# Altium project SVPXFMC_Carrier_3U.PrjPcb (part 7 of 7)

## Sheet SVPX_protection.SchDoc: SVPXFMC Carrier 3U
size A4; CheckedBy: \; Author: G.Kasprowicz; CompanyName: ISE; DrawnBy: T.Przywozki; Organization: WUT ISE; Address1: Warsaw University of Technology; Address2: Nowowiejska 15/19 00-665 Warsaw; Revision: 1.0.; SheetNumber: 19; SheetTotal: 20; Project: SVPXFMC Carrier 3U; ModifiedBy: -; CheckedDate: -; Title2: SpaceVPX interface protection; DivGrp: ISE; Designer: G. Kasprowicz
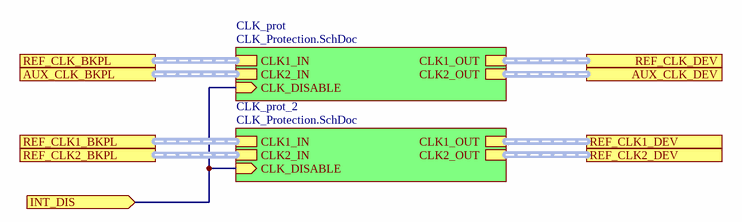
[diagram p19: SVPX_protection.SchDoc]

### Sub-sheets
CLK_prot = CLK_Protection.SchDoc: CLK_DISABLE (in), CLK1_IN (harness CLK), CLK2_IN (harness CLK), CLK2_OUT (harness CLK), CLK1_OUT (harness CLK)
CLK_prot_2 = CLK_Protection.SchDoc: CLK_DISABLE (in), CLK1_IN (harness CLK), CLK2_IN (harness CLK), CLK2_OUT (harness CLK), CLK1_OUT (harness CLK)

### Ports
AUX_CLK_BKPL (harness CLK), AUX_CLK_DEV (harness CLK), INT_DIS (in), REF_CLK1_BKPL (harness CLK), REF_CLK1_DEV (harness CLK), REF_CLK2_BKPL (harness CLK), REF_CLK2_DEV (harness CLK), REF_CLK_BKPL (harness CLK), REF_CLK_DEV (harness CLK)

### Nets
DIS_LVDS: port INT_DIS, sheet CLK_prot/CLK_DISABLE, sheet CLK_prot_2/CLK_DISABLE

### Buses and harness runs
harness port AUX_CLK_BKPL = sheet CLK_prot/CLK2_IN
harness port AUX_CLK_DEV = sheet CLK_prot/CLK2_OUT
harness port REF_CLK1_BKPL = sheet CLK_prot_2/CLK1_IN
harness port REF_CLK1_DEV = sheet CLK_prot_2/CLK1_OUT
harness port REF_CLK2_BKPL = sheet CLK_prot_2/CLK2_IN
harness port REF_CLK2_DEV = sheet CLK_prot_2/CLK2_OUT
harness port REF_CLK_BKPL = sheet CLK_prot/CLK1_IN
harness port REF_CLK_DEV = sheet CLK_prot/CLK1_OUT

### Notes on the sheet
- Project/Equipment
- Document
- Designer
- Drawn by
- Check.by
- Copyright WUT ISE 2019
  This documentation describes Open Hardware and is licensed under the CERN OHL v.1.1. You may redistribute and modify this documentation under the terms of the CERN OHL v1.1.
  (http://ohwr.org/CERNOHL). This documentation is dristributed WITHOUT ANY EXPRESS OR IMPLIED WARRANTY, INCLUDING OF MERCHANTABILITY, SATISFACTORY QUALITY AND FITNESS FOR A PARTICULAR PURPOSE. Please see the CERN OHL v.1.1 for applicable conditions
- File
- Last Mod.
- Print Date
- Sheet
- Size
- A4
- of
- Rev

## Sheet CLK_Protection.SchDoc: SVPXFMC Carrier 3U
size A4; CheckedBy: \; Author: G.Kasprowicz; CompanyName: ISE; DrawnBy: T.Przywozki; Organization: WUT ISE; Address1: Warsaw University of Technology; Address2: Nowowiejska 15/19 00-665 Warsaw; Revision: 1.0.; SheetNumber: 20; SheetTotal: 20; Project: SVPXFMC Carrier 3U; ModifiedBy: -; CheckedDate: -; Title2: Clock protection; DivGrp: ISE; Designer: G. Kasprowicz
Used 2 times, as channels U_SVPX_protection/CLK_prot, U_SVPX_protection/CLK_prot_2. Parts and nets are listed once, with the designators drawn on the sheet.
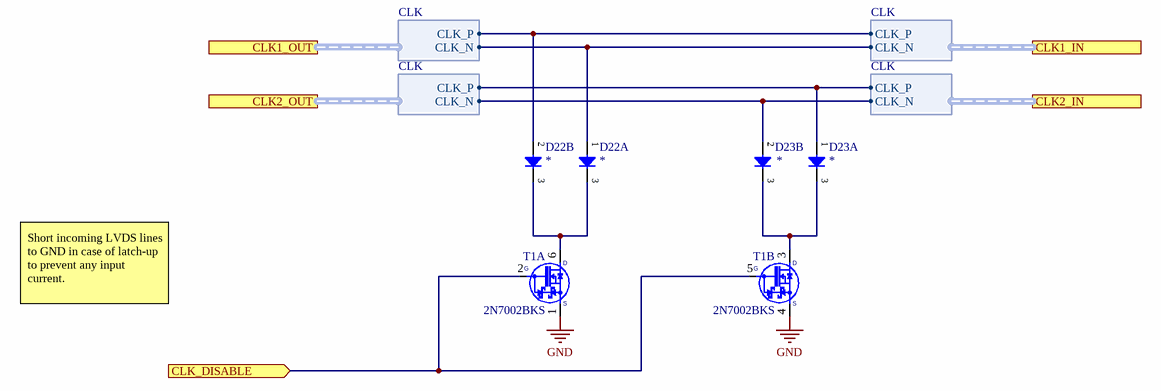
[diagram p20: CLK_Protection.SchDoc]

### Parts
D22  *  [SOT65P210X110-3N]  (parts A,B of 2)
D23  *  [SOT65P210X110-3N]  (parts A,B of 2)
T1  2N7002BKS  [SOT65P210X110-6N]  (parts A,B of 2)

### Ports
CLK1_IN (harness CLK), CLK1_OUT (harness CLK), CLK2_IN (harness CLK), CLK2_OUT (harness CLK), CLK_DISABLE (in)

### Harnesses
CLK: CLK_P, CLK_N

### Nets
GND: T1.1(S) T1.4(S)
CLK_DISABLE: T1.2(G) T1.5(G) ; port CLK_DISABLE
NetD22_1: D22.1(A) ; port CLK1_IN.CLK_N, port CLK1_OUT.CLK_N
NetD22_2: D22.2(A) ; port CLK1_IN.CLK_P, port CLK1_OUT.CLK_P
NetD22_3: D22.3(COMC) T1.6(D)
NetD23_1: D23.1(A) ; port CLK2_IN.CLK_P, port CLK2_OUT.CLK_P
NetD23_2: D23.2(A) ; port CLK2_IN.CLK_N, port CLK2_OUT.CLK_N
NetD23_3: D23.3(COMC) T1.3(D)

### Channels
U_SVPX_protection/CLK_prot: designators end in A; ports CLK_DISABLE=DIS_LVDS
U_SVPX_protection/CLK_prot_2: designators end in B; ports CLK_DISABLE=DIS_LVDS

### Notes on the sheet
- Short incoming LVDS lines to GND in case of latch-up to prevent any input current.
- Project/Equipment
- Document
- Designer
- Drawn by
- Check.by
- Copyright WUT ISE 2019
  This documentation describes Open Hardware and is licensed under the CERN OHL v.1.1. You may redistribute and modify this documentation under the terms of the CERN OHL v1.1.
  (http://ohwr.org/CERNOHL). This documentation is dristributed WITHOUT ANY EXPRESS OR IMPLIED WARRANTY, INCLUDING OF MERCHANTABILITY, SATISFACTORY QUALITY AND FITNESS FOR A PARTICULAR PURPOSE. Please see the CERN OHL v.1.1 for applicable conditions
- File
- Last Mod.
- Print Date
- Sheet
- Size
- A4
- of
- Rev

### Library data of the parts
D22 D23 = BAT1705WH: Manufacturer Part Number: BAT1705WH6327; Bonding: No; PressFit: No; Case: *; Component Kind: Standard; Component Type: Standard; ComponentHeigth: *; CreateDate: 2018-01-01; Device: *; Footprint: *; HelpURL: *; LatestRevisionDate: 2018-01-01; Manufacturer: *; Mounted: Yes; PackageDescription: *; Part Description: *; Part Number: BAT1705WH6327; Pin Count: *; Sense: No; SMD: Yes; Socket: No; Value: *
T1 = 2N7002BKS: 60V, 300mA Dual N-Channel Trench MOSFET; Manufacturer: NXP SEMICONDUCTORS; Manufacturer Part Number: 2N7002BKS6; PressFit: No; Bonding: No; Part Number: 2N7002BKS; Component Kind: Standard; Component Type: Standard; Device: 2N7002BKS; PackageDescription: SOT363, SC70-6, SOT, 0.65mm Pitch, 6 pin, 1.25mm W X 2.00mm L X 1.10mm H, IPC Medium Density; Part Description: 60 V, 300 mA Dual N-Channel Trench MOSFET; Pin Count: 4; Case: SOT363; Mounted: Yes; Socket: No; SMD: Yes; Sense: No; ComponentHeight: 1.1mm; HelpURL: \\cern.ch\dfs\Applications\Altium\Datasheets\2N7002BKS.pdf; Author: CERN DEM JLC; CreateDate: 2012-11-27; LatestRevisionDate: 2012-11-27

## Nets that join several sheets
3.3V_AUX: Power_supply (C204.2 IC2.3 IC2.4 R64.1), SLT3-PAY-1Q2T_P0 (C174.2 P0.D5)
GND: SVPXFMC_Carrier_3U (C211.2 C212.2 R150.1 R151.1), Interface_Protection (C230.2 IC13.7 IC14.7), FMC_connector (176 pins), Power_supply (96 pins), FPGA SDRAM bank (28 pins), FPGA Supply (105 pins), FPGA_Config (17 pins), Decoupling_caps (79 pins), FPGA_SpW_Misc (6 pins), SLT3-PAY-1Q2T_P0 (14 pins), SLT3-PAY-1Q2T_P1 (41 pins), SLT3-PAY-1Q2T_P2 (40 pins), Management (13 pins), MSP430_power_jtag (17 pins), WR_OSC (17 pins), U_SVPX_protection/CLK_prot (T1A.1 T1A.4), U_SVPX_protection/CLK_prot_2 (T1B.1 T1B.4)
P1V2_CORE: Power_supply (6 pins), FPGA Supply (22 pins), FPGA_Config (IC15.5), Decoupling_caps (25 pins)
P1V2_SERDES: Power_supply (L11.2), FPGA Supply (14 pins)
P1V8: Power_supply (IC6.5 R44.2 R74.2 TP12.1), FPGA SDRAM bank (27 pins), FPGA Supply (15 pins), Decoupling_caps (16 pins)
P2V5: Power_supply (6 pins), FPGA Supply (15 pins), FPGA_Config (IC17.5), Decoupling_caps (18 pins), FPGA_SpW_Misc (C225.2 IC22.1 IC22.4), WR_OSC (R104.2 R105.2 R122.2 R123.2)
P2V5_PLL: Power_supply (L5.2), FPGA Supply (R33.2 R34.2), Decoupling_caps (C128.1 C135.1)
P3V3: FPGA_Misc (R115.2 R117.2 R154.1 R155.1), Power_supply (10 pins), FPGA Supply (9 pins), FPGA_Config (20 pins), Decoupling_caps (7 pins), WR_OSC (L12.1 L13.1 R86.1)
P3V3_PLL: Power_supply (L7.2), FPGA Supply (12 pins), Decoupling_caps (5 pins)
P3V3MP: Interface_Protection (C230.1 IC13.14 IC14.14), Power_supply (5 pins), Decoupling_caps (6 pins), Management (19 pins), MSP430_power_jtag (11 pins)
VS1: Power_supply (40 pins), SLT3-PAY-1Q2T_P0 (7 pins)
3P3V: FMC_connector (8 pins), Power_supply (L10.2)
3P3VAUX: FMC_connector (C193.2 J2.d32), Power_supply (L3.2)
12P0V: FMC_connector (5 pins), Power_supply (L8.2)
AUX_CLK_A_N: FPGA_SpW_Misc (U8.V16), SLT3-PAY-1Q2T_P0 (P0.C8), U_SVPX_protection/CLK_prot (D23A.2)
AUX_CLK_A_P: FPGA_SpW_Misc (U8.W16), SLT3-PAY-1Q2T_P0 (P0.B8), U_SVPX_protection/CLK_prot (D23A.1)
AUX_CLK_B_N: FPGA_SpW_Misc (U8.AA18), SLT3-PAY-1Q2T_P1 (P1.G7), U_SVPX_protection/CLK_prot_2 (D23B.2)
AUX_CLK_B_P: FPGA_SpW_Misc (U8.AB17), SLT3-PAY-1Q2T_P1 (P1.G9), U_SVPX_protection/CLK_prot_2 (D23B.1)
CLK0_M2C_N: FMC_connector (J2.h5), FPGA_FMC (U8.J4)
CLK0_M2C_P: FMC_connector (J2.h4), FPGA_FMC (U8.J3)
CLK1_M2C_N: FMC_connector (J2.g3), FPGA_FMC (U8.L8)
CLK1_M2C_P: FMC_connector (J2.g2), FPGA_FMC (U8.K8)
CORE_SENSE+: Power_supply (R62.1), FPGA Supply (NT1.1)
CPtp01-DA_N: FPGA_SpW_Misc (D4.2 U8.T13), SLT3-PAY-1Q2T_P1 (P1.B15)
CPtp01-DA_P: FPGA_SpW_Misc (D4.1 U8.U13), SLT3-PAY-1Q2T_P1 (P1.A15)
CPtp01-DB_N: FPGA_SpW_Misc (U8.U15), SLT3-PAY-1Q2T_P1 (P1.E15)
CPtp01-DB_P: FPGA_SpW_Misc (U8.U14), SLT3-PAY-1Q2T_P1 (P1.D15)
CPtp01-DC_N: FPGA_SpW_Misc (D13.2 U8.V14), SLT3-PAY-1Q2T_P1 (P1.C16)
CPtp01-DC_P: FPGA_SpW_Misc (D13.1 U8.V13), SLT3-PAY-1Q2T_P1 (P1.B16)
CPtp01-DD_N: FPGA_SpW_Misc (U8.W15), SLT3-PAY-1Q2T_P1 (P1.F16)
CPtp01-DD_P: FPGA_SpW_Misc (U8.Y15), SLT3-PAY-1Q2T_P1 (P1.E16)
CPtp02-DA_N: FPGA_SpW_Misc (D8.2 U8.AA17), SLT3-PAY-1Q2T_P1 (P1.B13)
CPtp02-DA_P: FPGA_SpW_Misc (D8.1 U8.AA16), SLT3-PAY-1Q2T_P1 (P1.A13)
CPtp02-DB_N: FPGA_SpW_Misc (U8.W17), SLT3-PAY-1Q2T_P1 (P1.E13)
CPtp02-DB_P: FPGA_SpW_Misc (U8.Y17), SLT3-PAY-1Q2T_P1 (P1.D13)
CPtp02-DC_N: FPGA_SpW_Misc (D11.2 U8.Y13), SLT3-PAY-1Q2T_P1 (P1.C14)
CPtp02-DC_P: FPGA_SpW_Misc (D11.1 U8.AA13), SLT3-PAY-1Q2T_P1 (P1.B14)
CPtp02-DD_N: FPGA_SpW_Misc (U8.W14), SLT3-PAY-1Q2T_P1 (P1.F14)
CPtp02-DD_P: FPGA_SpW_Misc (U8.Y14), SLT3-PAY-1Q2T_P1 (P1.E14)
DIS_LVDS: Power_supply (R85.2 T3.3), FPGA_SpW_Misc (T2.2 T2.5 T5.2 T5.5), U_SVPX_protection/CLK_prot (T1A.2 T1A.5), U_SVPX_protection/CLK_prot_2 (T1B.2 T1B.5)
DP0_C2M_N: FMC_connector (J2.c3), FPGA_MGT (R165.2)
DP0_C2M_P: FMC_connector (J2.c2), FPGA_MGT (R163.2)
DP0_M2C_N: FMC_connector (J2.c7), FPGA_MGT (R164.2)
DP0_M2C_P: FMC_connector (J2.c6), FPGA_MGT (R162.2)
DP1_C2M_N: FMC_connector (J2.a23), FPGA_MGT (R173.2)
DP1_C2M_P: FMC_connector (J2.a22), FPGA_MGT (R171.2)
DP1_M2C_N: FMC_connector (J2.a3), FPGA_MGT (R172.2)
DP1_M2C_P: FMC_connector (J2.a2), FPGA_MGT (R170.2)
DP2_C2M_N: FMC_connector (J2.a27), FPGA_MGT (R181.2)
DP2_C2M_P: FMC_connector (J2.a26), FPGA_MGT (R179.2)
DP2_M2C_N: FMC_connector (J2.a7), FPGA_MGT (R180.2)
DP2_M2C_P: FMC_connector (J2.a6), FPGA_MGT (R178.2)
DP3_C2M_N: FMC_connector (J2.a31), FPGA_MGT (R189.2)
DP3_C2M_P: FMC_connector (J2.a30), FPGA_MGT (R187.2)
DP3_M2C_N: FMC_connector (J2.a11), FPGA_MGT (R188.2)
DP3_M2C_P: FMC_connector (J2.a10), FPGA_MGT (R186.2)
EN_IFC: Interface_Protection (8 pins), Power_supply (D7.2 R110.1)
EXT_RST_2: FPGA_Config (C210.2), Management (IC31.53)
FLASH_GOLDENn: FPGA_Config (R92.2 U8.D22), Management (IC31.11)
FMC_P12V0_MSP430: Power_supply (R63.1), Management (IC31.36)
FMC_P12V0_ONn: FPGA_Misc (U8.J18), Power_supply (IC9.4 R63.2 R83.2)
FMC_P12V0_OVCn: Power_supply (IC9.7 R81.2), Management (IC31.58)
FMC_SCL: FMC_connector (J2.c30), FPGA_Misc (R115.1 U8.R22)
FMC_SDA: FMC_connector (J2.c31), FPGA_Misc (R117.1 U8.P22)
GA0: SLT3-PAY-1Q2T_P0 (P0.A6), Management (IC31.44 R130.1)
GA1: SLT3-PAY-1Q2T_P0 (P0.B6), Management (IC31.45 R131.1)
GA2: SLT3-PAY-1Q2T_P0 (P0.F6), Management (IC31.46 R132.1)
GA3: SLT3-PAY-1Q2T_P0 (P0.G6), Management (IC31.47 R133.1)
GA4: SLT3-PAY-1Q2T_P0 (P0.F5), Management (IC31.48 R134.1)
GAP: SLT3-PAY-1Q2T_P0 (P0.G5), Management (IC31.49 R135.1)
GBTCLK0_M2C_N: FMC_connector (J2.d5), FPGA_MGT (U8.T1)
GBTCLK0_M2C_P: FMC_connector (J2.d4), FPGA_MGT (U8.U1)
GPIO_A1: Interface_Protection (IC14.1), Management (IC31.41)
GPIO_A2: Interface_Protection (IC14.4), Management (IC31.42)
GPIO_A3: Interface_Protection (IC14.8), Management (IC31.43)
GPIO_A4: Interface_Protection (IC14.11), Management (IC31.35)
GPIO_S1: Interface_Protection (IC14.2), FPGA_Misc (U8.N19)
GPIO_S2: Interface_Protection (IC14.3), FPGA_Misc (U8.N20)
GPIO_S3: Interface_Protection (IC14.9), FPGA_Misc (U8.N21)
GPIO_S4: Interface_Protection (IC14.10), FPGA_Misc (U8.N22)
Helper_DCXO_N: FPGA_SpW_Misc (U8.Y19), WR_OSC (6 pins)
Helper_DCXO_OE: FPGA_Misc (U8.P16), WR_OSC (R124.1 R129.1)
Helper_DCXO_P: FPGA_SpW_Misc (U8.Y18), WR_OSC (6 pins)
Helper_DCXO_SCL: FPGA_Misc (U8.N17), WR_OSC (OSC2.8 R121.1 TP8.1)
Helper_DCXO_SDA: FPGA_Misc (U8.N16), WR_OSC (OSC2.7 R120.1 TP7.1)
Imeas_P1V2: Power_supply (C22.2 IC7.4 R47.1), Management (IC31.17)
Imeas_P1V8: Power_supply (C85.2 IC7.6 R75.1), Management (IC31.18)
Imeas_P2V5: Power_supply (C25.2 IC7.8 R26.1), Management (IC31.31)
Imeas_P3V3: Power_supply (C26.2 IC7.10 R27.1), Management (IC31.29)
Imeas_P3V3MP: Power_supply (C205.2 R97.1), Management (IC31.63)
Imeas_P12V0: Power_supply (C75.2 R45.1), Management (IC31.30)
LA00_CC_N: FMC_connector (J2.g7), FPGA_FMC (U8.L7)
LA00_CC_P: FMC_connector (J2.g6), FPGA_FMC (U8.M7)
LA01_CC_N: FMC_connector (J2.d9), FPGA_FMC (U8.K5)
LA01_CC_P: FMC_connector (J2.d8), FPGA_FMC (U8.K4)
LA02_N: FMC_connector (J2.h8), FPGA_FMC (U8.T3)
LA02_P: FMC_connector (J2.h7), FPGA_FMC (U8.T4)
LA03_N: FMC_connector (J2.g10), FPGA_FMC (U8.R1)
LA03_P: FMC_connector (J2.g9), FPGA_FMC (U8.R2)
LA04_N: FMC_connector (J2.h11), FPGA_FMC (U8.N4)
LA04_P: FMC_connector (J2.h10), FPGA_FMC (U8.N3)
LA05_N: FMC_connector (J2.d12), FPGA_FMC (U8.P3)
LA05_P: FMC_connector (J2.d11), FPGA_FMC (U8.P4)
LA06_N: FMC_connector (J2.c11), FPGA_FMC (U8.R4)
LA06_P: FMC_connector (J2.c10), FPGA_FMC (U8.R3)
LA07_N: FMC_connector (J2.h14), FPGA_FMC (U8.N6)
LA07_P: FMC_connector (J2.h13), FPGA_FMC (U8.N5)
LA08_N: FMC_connector (J2.g13), FPGA_FMC (U8.L3)
LA08_P: FMC_connector (J2.g12), FPGA_FMC (U8.L2)
LA09_N: FMC_connector (J2.d15), FPGA_FMC (U8.M2)
LA09_P: FMC_connector (J2.d14), FPGA_FMC (U8.M3)
LA10_N: FMC_connector (J2.c15), FPGA_FMC (U8.P2)
LA10_P: FMC_connector (J2.c14), FPGA_FMC (U8.P1)
LA11_N: FMC_connector (J2.h17), FPGA_FMC (U8.M6)
LA11_P: FMC_connector (J2.h16), FPGA_FMC (U8.M5)
LA12_N: FMC_connector (J2.g16), FPGA_FMC (U8.L5)
LA12_P: FMC_connector (J2.g15), FPGA_FMC (U8.L4)
LA13_N: FMC_connector (J2.d18), FPGA_FMC (U8.K2)
LA13_P: FMC_connector (J2.d17), FPGA_FMC (U8.K1)
LA14_N: FMC_connector (J2.c19), FPGA_FMC (U8.M1)
LA14_P: FMC_connector (J2.c18), FPGA_FMC (U8.N1)
LA15_N: FMC_connector (J2.h20), FPGA_FMC (U8.M8)
LA15_P: FMC_connector (J2.h19), FPGA_FMC (U8.N8)
LA16_N: FMC_connector (J2.g19), FPGA_FMC (U8.P7)
LA16_P: FMC_connector (J2.g18), FPGA_FMC (U8.P6)
LA17_CC_N: FMC_connector (J2.d21), FPGA_FMC (U8.K7)
LA17_CC_P: FMC_connector (J2.d20), FPGA_FMC (U8.K6)
LA18_CC_N: FMC_connector (J2.c23), FPGA_FMC (U8.J2)
LA18_CC_P: FMC_connector (J2.c22), FPGA_FMC (U8.J1)
LA19_N: FMC_connector (J2.h23), FPGA_FMC (U8.G7)
LA19_P: FMC_connector (J2.h22), FPGA_FMC (U8.H7)
LA20_N: FMC_connector (J2.g22), FPGA_FMC (U8.J6)
LA20_P: FMC_connector (J2.g21), FPGA_FMC (U8.H6)
LA21_N: FMC_connector (J2.h26), FPGA_FMC (U8.F4)
LA21_P: FMC_connector (J2.h25), FPGA_FMC (U8.F3)
LA22_N: FMC_connector (J2.g25), FPGA_FMC (U8.H5)
LA22_P: FMC_connector (J2.g24), FPGA_FMC (U8.H4)
LA23_N: FMC_connector (J2.d24), FPGA_FMC (U8.E2)
LA23_P: FMC_connector (J2.d23), FPGA_FMC (U8.E1)
LA24_N: FMC_connector (J2.h29), FPGA_FMC (U8.F6)
LA24_P: FMC_connector (J2.h28), FPGA_FMC (U8.F5)
LA25_N: FMC_connector (J2.g28), FPGA_FMC (U8.G6)
LA25_P: FMC_connector (J2.g27), FPGA_FMC (U8.G5)
LA26_N: FMC_connector (J2.d27), FPGA_FMC (U8.G1)
LA26_P: FMC_connector (J2.d26), FPGA_FMC (U8.H1)
LA27_N: FMC_connector (J2.c27), FPGA_FMC (U8.E5)
LA27_P: FMC_connector (J2.c26), FPGA_FMC (U8.E4)
LA28_N: FMC_connector (J2.h32), FPGA_FMC (U8.B3)
LA28_P: FMC_connector (J2.h31), FPGA_FMC (U8.C3)
LA29_N: FMC_connector (J2.g31), FPGA_FMC (U8.D4)
LA29_P: FMC_connector (J2.g30), FPGA_FMC (U8.D3)
LA30_N: FMC_connector (J2.h35), FPGA_FMC (U8.D2)
LA30_P: FMC_connector (J2.h34), FPGA_FMC (U8.D1)
LA31_N: FMC_connector (J2.g34), FPGA_FMC (U8.D5)
LA31_P: FMC_connector (J2.g33), FPGA_FMC (U8.C4)
LA32_N: FMC_connector (J2.h38), FPGA_FMC (U8.A2)
LA32_P: FMC_connector (J2.h37), FPGA_FMC (U8.B2)
LA33_N: FMC_connector (J2.g37), FPGA_FMC (U8.B1)
LA33_P: FMC_connector (J2.g36), FPGA_FMC (U8.C1)
Main_DCXO_N: FPGA_MGT (U8.U4), WR_OSC (C182.2 R104.1 R113.2)
Main_DCXO_OE: FPGA_Misc (U8.K17), WR_OSC (R108.1 R119.1)
Main_DCXO_P: FPGA_MGT (U8.U3), WR_OSC (C178.2 R105.1 R114.2)
Main_DCXO_SCL: FPGA_Misc (U8.K18), WR_OSC (OSC1.8 R103.1 TP6.1)
Main_DCXO_SDA: FPGA_Misc (U8.K16), WR_OSC (OSC1.7 R98.1 TP5.1)
MISO: Interface_Protection (IC13.2), FPGA_Misc (U8.M22)
MOSI: Interface_Protection (IC13.3), FPGA_Misc (U8.L21)
NetIC13_1: Interface_Protection (IC13.1), Management (IC31.66)
NetIC13_4: Interface_Protection (IC13.4), Management (IC31.65)
NetIC13_8: Interface_Protection (IC13.8), Management (IC31.67)
NetIC13_11: Interface_Protection (IC13.11), Management (IC31.68)
NetR152_2: FPGA_Misc (R154.2 U8.G17), SLT3-PAY-1Q2T_P1 (R152.2)
NetR153_2: FPGA_Misc (R155.2 U8.G16), SLT3-PAY-1Q2T_P1 (R153.2)
PG_C2M: FMC_connector (J2.d1), FPGA_Misc (U8.E22)
PG_M2C: FMC_connector (J2.f1), FPGA_Misc (U8.F18)
PG_P1V2: Power_supply (6 pins), Management (IC31.4)
PG_P1V8: Power_supply (D3.1 R16.1 R195.2 U3.15), Management (IC31.5)
PG_P2V5: Power_supply (D6.1 R76.1 R194.2 U6.15), Management (IC31.6)
PG_P3V3: Power_supply (D17.1 R94.1 R193.2 U7.15), Management (IC31.57)
PRSNT_M2C_L: FMC_connector (J2.h2), FPGA_Misc (U8.F20)
PWR_OVLn: Power_supply (8 pins), Management (IC31.15)
REF_CLK2_N: FPGA_SpW_Misc (U8.W11), SLT3-PAY-1Q2T_P1 (P1.G11), U_SVPX_protection/CLK_prot_2 (D22B.1)
REF_CLK2_P: FPGA_SpW_Misc (U8.V11), SLT3-PAY-1Q2T_P1 (P1.G13), U_SVPX_protection/CLK_prot_2 (D22B.2)
REF_CLK_A_N: FPGA_SpW_Misc (U8.Y9), SLT3-PAY-1Q2T_P0 (P0.F8), U_SVPX_protection/CLK_prot (D22A.1)
REF_CLK_A_P: FPGA_SpW_Misc (U8.W9), SLT3-PAY-1Q2T_P0 (P0.E8), U_SVPX_protection/CLK_prot (D22A.2)
RxD: Management (IC31.9), MSP430_power_jtag (R146.2)
SCK: Interface_Protection (IC13.9), FPGA_Misc (U8.M21)
SM0: SLT3-PAY-1Q2T_P0 (D21.2 P0.B5), Management (IC31.52 R161.2)
SM1: SLT3-PAY-1Q2T_P0 (D21.1 P0.A5), Management (IC31.51 R160.2)
SM2: SLT3-PAY-1Q2T_P0 (D16.1 P0.G4), MSP430_power_jtag (C173.2)
SM3: SLT3-PAY-1Q2T_P0 (D16.2 P0.F4), Management (R197.1 T4.3)
SS: Interface_Protection (IC13.10), FPGA_Misc (U8.L20)
SYNC: FPGA_Misc (U8.R17), Power_supply (R4.1 R17.1 R25.1 R59.1)
SYS_CON: SLT3-PAY-1Q2T_P1 (P1.G5), Management (D9.4 IC31.25)
SYS_CON_P: SLT3-PAY-1Q2T_P1 (P1.G1), Management (D9.3 IC31.26)
SYSRESET*: FPGA_Config (C206.2), SLT3-PAY-1Q2T_P0 (P0.B4 TP26.1)
TxD: Management (IC31.8), MSP430_power_jtag (R145.2)
Umeas_P1V2: Power_supply (C82.2 R24.1), Management (IC31.34)
Umeas_P1V8: Power_supply (C84.2 R74.1), Management (IC31.16)
Umeas_P2V5: Power_supply (C86.2 R79.2 R80.2), Management (IC31.33)
Umeas_P3V3: Power_supply (C87.2 R88.1 R90.2), Management (IC31.32)
Umeas_P3V3MP: Power_supply (C166.2 R87.2 R93.2), Management (IC31.64)
Umeas_P12V0: Power_supply (C23.2 R65.2 R72.2), Management (IC31.3)
UPD_SCK: FPGA_Config (R100.2), Management (IC31.71)
UPD_SDI: FPGA_Config (R109.2), Management (IC31.69)
UPD_SDO: FPGA_Config (R101.2), Management (IC31.70)
UPD_SS: FPGA_Config (R99.2), Management (IC31.72)
UTP01-RD0_N: FPGA_MGT (R166.2), SLT3-PAY-1Q2T_P1 (P1.B1)
UTP01-RD0_P: FPGA_MGT (R158.2), SLT3-PAY-1Q2T_P1 (P1.A1)
UTP01-TD0_N: FPGA_MGT (R167.2), SLT3-PAY-1Q2T_P1 (P1.E1)
UTP01-TD0_P: FPGA_MGT (R159.2), SLT3-PAY-1Q2T_P1 (P1.D1)
UTP02-RD0_N: FPGA_MGT (R174.2), SLT3-PAY-1Q2T_P1 (P1.C2)
UTP02-RD0_P: FPGA_MGT (R168.2), SLT3-PAY-1Q2T_P1 (P1.B2)
UTP02-TD0_N: FPGA_MGT (R175.2), SLT3-PAY-1Q2T_P1 (P1.F2)
UTP02-TD0_P: FPGA_MGT (R169.2), SLT3-PAY-1Q2T_P1 (P1.E2)
UTP03-RD0_N: FPGA_MGT (R182.2), SLT3-PAY-1Q2T_P1 (P1.B3)
UTP03-RD0_P: FPGA_MGT (R176.2), SLT3-PAY-1Q2T_P1 (P1.A3)
UTP03-TD0_N: FPGA_MGT (R183.2), SLT3-PAY-1Q2T_P1 (P1.E3)
UTP03-TD0_P: FPGA_MGT (R177.2), SLT3-PAY-1Q2T_P1 (P1.D3)
UTP04-RD0_N: FPGA_MGT (R190.2), SLT3-PAY-1Q2T_P1 (P1.C4)
UTP04-RD0_P: FPGA_MGT (R184.2), SLT3-PAY-1Q2T_P1 (P1.B4)
UTP04-TD0_N: FPGA_MGT (R191.2), SLT3-PAY-1Q2T_P1 (P1.F4)
UTP04-TD0_P: FPGA_MGT (R185.2), SLT3-PAY-1Q2T_P1 (P1.E4)
VADJ: FMC_connector (7 pins), Power_supply (L9.2)
VIO_B_M2C: FMC_connector (J2.j39 J2.k40), Power_supply (R156.2)

## Assembly variants
Default: not fitted R162 R163 R164 R165 R170 R171 R172 R173 R178 R179 R180 R181 R186 R187 R188 R189